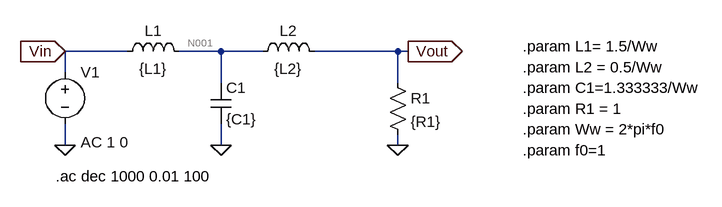
[diagram p0: schematic TS6_E2.asc]
TS6_E2.asc, the LTspice schematic file:
Version 4
SHEET 1 932 680
WIRE 16 96 -80 96
WIRE 160 96 96 96
WIRE 224 96 160 96
WIRE 432 96 304 96
WIRE 448 96 432 96
WIRE -80 128 -80 96
WIRE 160 144 160 96
WIRE 432 144 432 96
WIRE -80 240 -80 208
WIRE 160 240 160 208
WIRE 432 240 432 224
FLAG -80 240 0
FLAG 160 240 0
FLAG 432 240 0
FLAG -80 96 Vin
IOPIN -80 96 In
FLAG 448 96 Vout
IOPIN 448 96 Out
SYMBOL ind 0 112 R270
WINDOW 0 32 56 VTop 2
WINDOW 3 5 56 VBottom 2
SYMATTR InstName L1
SYMATTR Value {L1}
SYMBOL ind 208 112 R270
WINDOW 0 32 56 VTop 2
WINDOW 3 5 56 VBottom 2
SYMATTR InstName L2
SYMATTR Value {L2}
SYMBOL cap 144 144 R0
SYMATTR InstName C1
SYMATTR Value {C1}
SYMBOL res 416 128 R0
SYMATTR InstName R1
SYMATTR Value {R1}
SYMBOL voltage -80 112 R0
WINDOW 123 24 124 Left 2
WINDOW 39 0 0 Left 0
SYMATTR InstName V1
SYMATTR Value ""
SYMATTR Value2 AC 1 0
TEXT -94 288 Left 2 !.ac dec 1000 0.01 100
TEXT 624 88 Left 2 !.param L1= 1.5/Ww
TEXT 624 120 Left 2 !.param L2 = 0.5/Ww
TEXT 624 152 Left 2 !.param C1=1.333333/Ww
TEXT 624 184 Left 2 !.param R1 = 1
TEXT 624 216 Left 2 !.param Ww = 2*pi*f0
TEXT 624 248 Left 2 !.param f0=1

The netlist it stands for:
* TS6_E2.asc
L1 Vin N001 {L1}
L2 N001 Vout {L2}
C1 N001 0 {C1}
R1 Vout 0 {R1}
V1 Vin 0 AC 1 0
.ac dec 1000 0.01 100
.param L1= 1.5/Ww
.param L2 = 0.5/Ww
.param C1=1.333333/Ww
.param R1 = 1
.param Ww = 2*pi*f0
.param f0=1
.backanno
.end

* Results of the author's LTspice run, read from the files saved beside the schematic
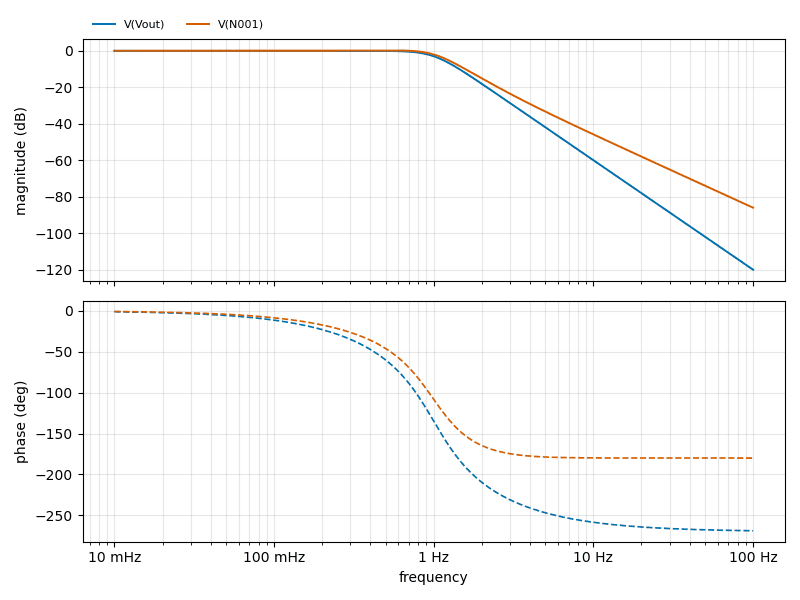
[diagram p1: AC Analysis of TS6_E2.asc, plotted from the saved traces]
* AC Analysis, 1 run:
*   V(Vout): -0.02 dB at 10 mHz, -120.00 dB at 100 Hz, peak -0.02 dB at 221.3 mHz, 3 dB below the peak at 1.001 Hz
*   V(N001): -0.01 dB at 10 mHz, -86.02 dB at 100 Hz, peak 0.20 dB at 533.3 mHz, 3 dB below the peak at 1.064 Hz